# Altium project ZX_UNO_Aplus_HAT2.PrjPcb
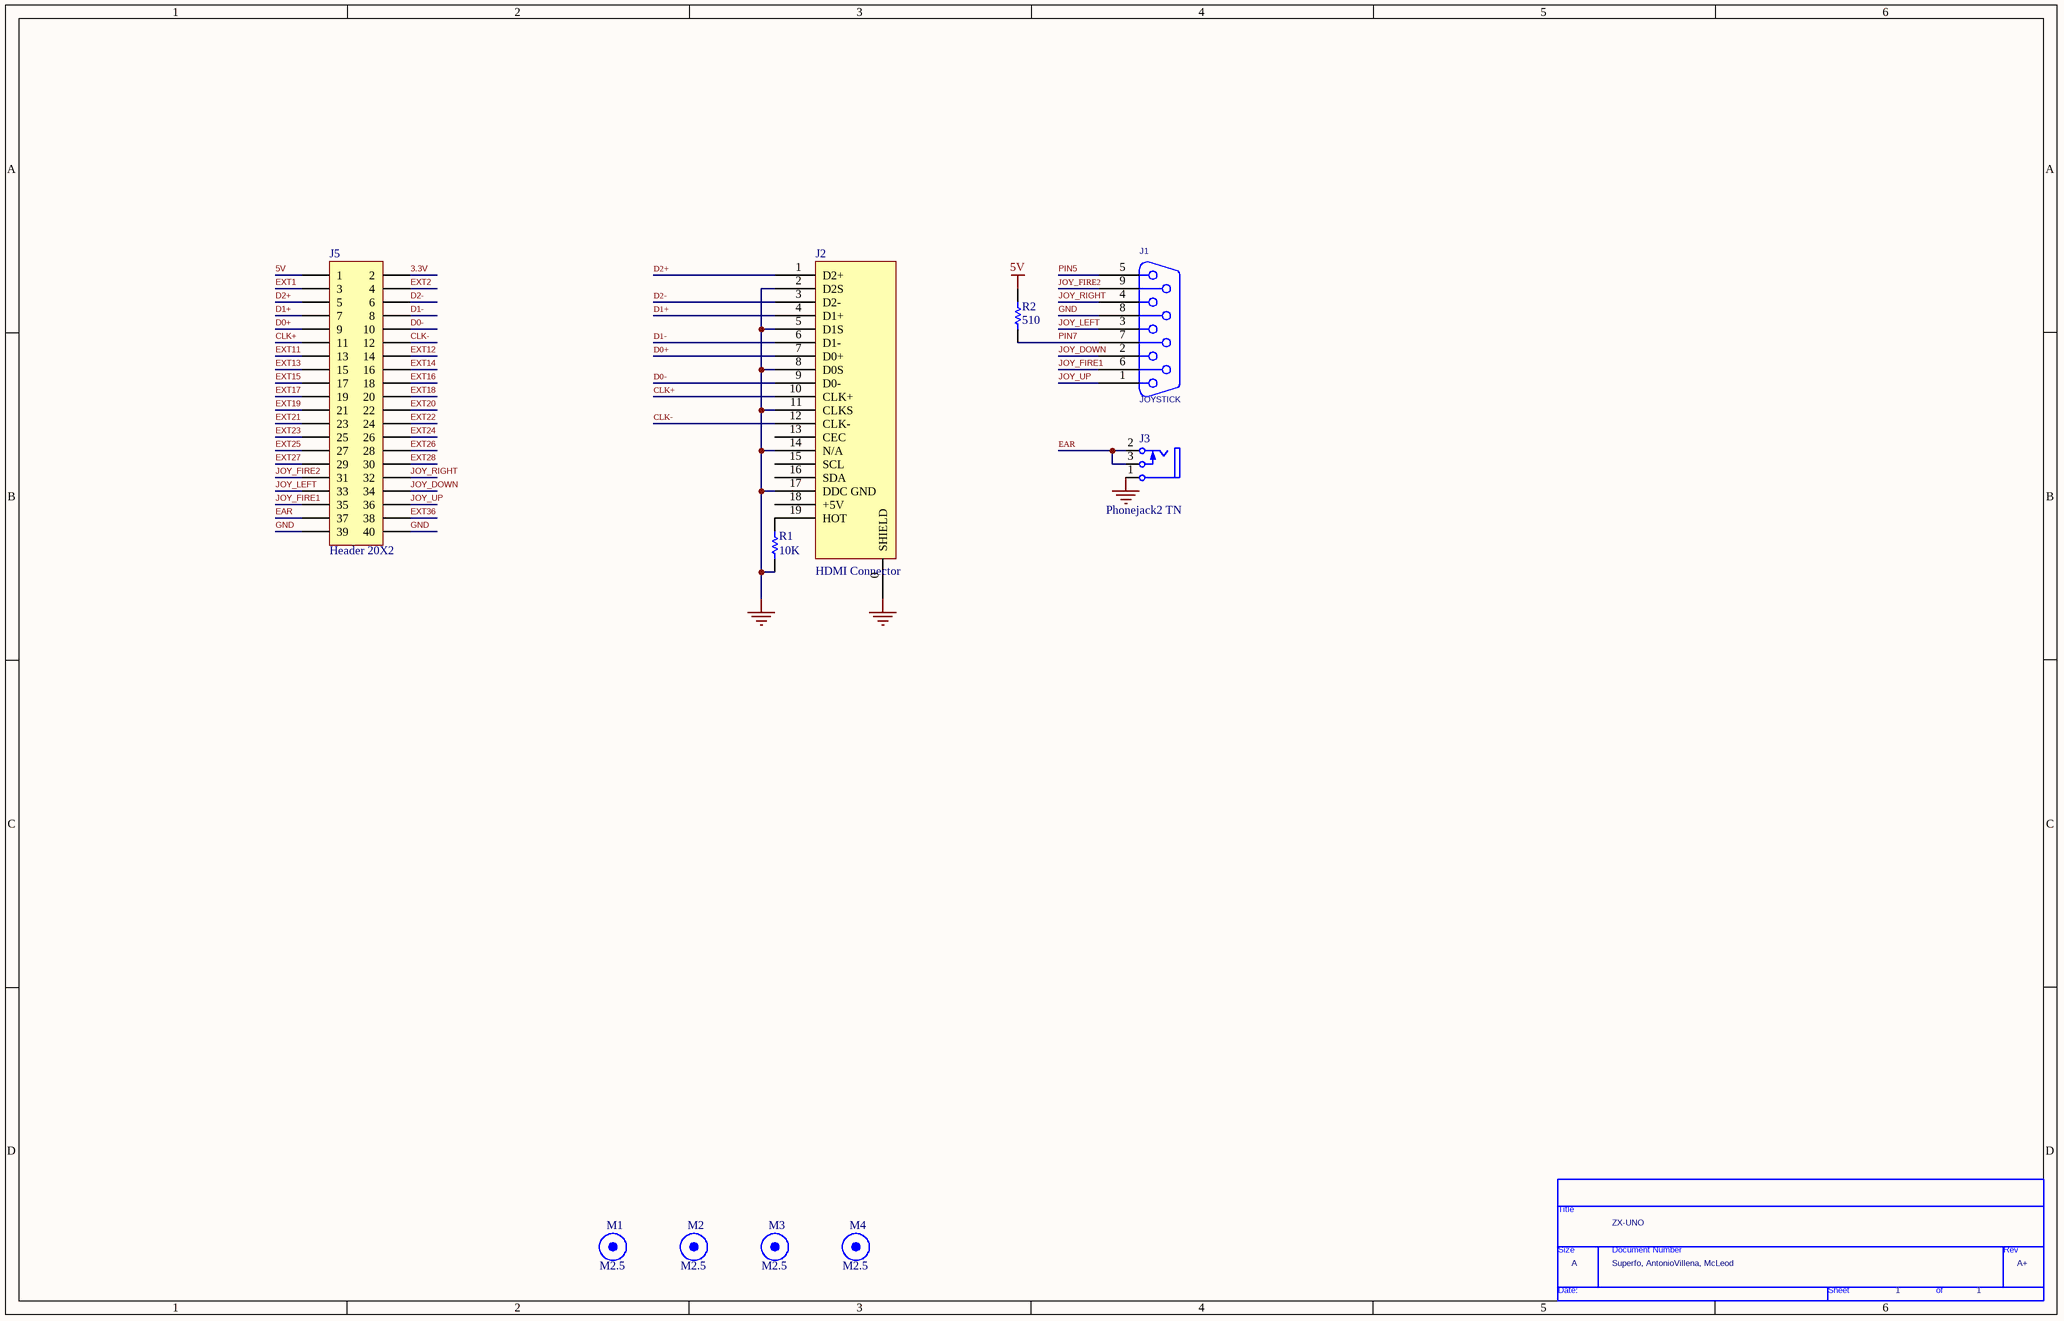
[diagram p0: ZX_UNO_Aplus_HAT2.SchDoc]
1 sheet, 11 parts. Net scope: global (net labels, ports and power ports of the same name join across sheets).
Board file: ZX_UNO_Aplus_HAT2.PcbDoc

## Sheet ZX_UNO_Aplus_HAT2.SchDoc
size 386 x 246 mm

### Parts
*  Page Count: 1  Page Size: A  Title: ZX-UNO  RevCode: A+  Doc: Superfo, AntonioVillena, McLeod  (hidden comment: TitleBlock0)  (graphical)
J1  JOYSTICK  [DSUB/RP.318/TM/9]
J2  HDMI Connector  [HDMI 10029449]
J3  Phonejack2 TN  [AUDIO  JACK MJ-3523-SMT]
J5  Header 20X2  [HDR2X20]
M1  M2.5  [M2.5]
M2  M2.5  [M2.5]
M3  M2.5  [M2.5]
M4  M2.5  [M2.5]
R1  value 10K  [SM/R_0805]  (hidden comment: Res1)
R2  value 510  [SM/R_0805]  (hidden comment: Res1)

### Nets
5V: J5.1 R2.2
GND: J1.8 J2.0(SHIELD) J2.2(D2S) J2.5(D1S) J2.8(D0S) J2.11(CLKS) J2.14(N/A) J2.17(DDC_GND) J3.1(S) J5.39 J5.40 R1.1
3.3V: J5.2
CLK+: J2.10(CLK+) J5.11
CLK-: J2.12(CLK-) J5.12
D0+: J2.7(D0+) J5.9
D0-: J2.9(D0-) J5.10
D1+: J2.4(D1+) J5.7
D1-: J2.6(D1-) J5.8
D2+: J2.1(D2+) J5.5
D2-: J2.3(D2-) J5.6
EAR: J3.2(T) J3.3(TN) J5.37
EXT1: J5.3
EXT2: J5.4
EXT11: J5.13
EXT12: J5.14
EXT13: J5.15
EXT14: J5.16
EXT15: J5.17
EXT16: J5.18
EXT17: J5.19
EXT18: J5.20
EXT19: J5.21
EXT20: J5.22
EXT21: J5.23
EXT22: J5.24
EXT23: J5.25
EXT24: J5.26
EXT25: J5.27
EXT26: J5.28
EXT27: J5.29
EXT28: J5.30
EXT36: J5.38
JOY_DOWN: J1.2 J5.34
JOY_FIRE1: J1.6 J5.35
JOY_FIRE2: J1.9 J5.31
JOY_LEFT: J1.3 J5.33
JOY_RIGHT: J1.4 J5.32
JOY_UP: J1.1 J5.36
PIN5: J1.5
PIN7: J1.7 R2.1
NetJ2_19: J2.19(HOT) R1.2

Not connected (* = marked no-connect by the designer): J2 13(CEC) 15(SCL) 16(SDA) 18(+5V)

### Notes on the sheet
- (in symbol TitleBlock0) Title; Size; Document Number; Rev; Date:; Sheet; of

### Library data of the parts
J1 = CONNECTOR DB9: COMPHEIGHT: 0.000; MEMORY: NO; COMPFIXED: YES; COMPGROUP: 0; COMPROT: 270; COMPLOC: [2950.000,1600.000]; COMPSIDE: TOP; DECOUPLER: NO; COMPKEY: NO; COMPLOCKED: NO
J2 = D-300-0056: HDMI, SMD, R/A KDMIX-NS1-WS-B; Connector type: Right Angle; Max Current: mA; Mounting Technology: Surface Mount; Pin Count: 19; Status: Unreleased; Category: Connector
J3 = Phonejack2 TN: Jack Socket, 3.5mm, Thru-Hole, Vertical, 2-Conductor with Tip closed; PackageDocument: 2003; PCB_Layout: Complies with manufacturer's recommendation.; DrillAndSlotSize: Corresponds to nominal value.; LatestRevisionDate: 15-Jul-2004; LatestRevisionNote: Component Replaced & renamed from "Phonejack".; DatasheetDocument: 2003; PackageReference: S1VS_SNB; Publisher: Altium Limited; ComponentLink1Description: Manufacturer Link; ComponentLink1URL: http://www.cliffuk.co.uk/
J5 = Header 20X2: Header, 20-Pin, Dual row; LatestRevisionDate: 17-Jul-2002; LatestRevisionNote: Re-released for DXP Platform.; Publisher: Altium Limited
R1 R2 = Res1: Resistor; Published: 8-Jun-2000; LatestRevisionDate: 17-Jul-2002; LatestRevisionNote: Re-released for DXP Platform.; PackageReference: AXIAL-0.3; Publisher: Altium Limited
* = TitleBlock0: Page Number: 1; Page Create Date: March  8, 1995